# Altium schematic sheet DriverSignals.SchDoc: Driver Signals
size A4; CompanyName: TM; DrawnBy: Juan Tinazzo; SheetNumber: 6; SheetTotal: 7; Number: CB_DRV
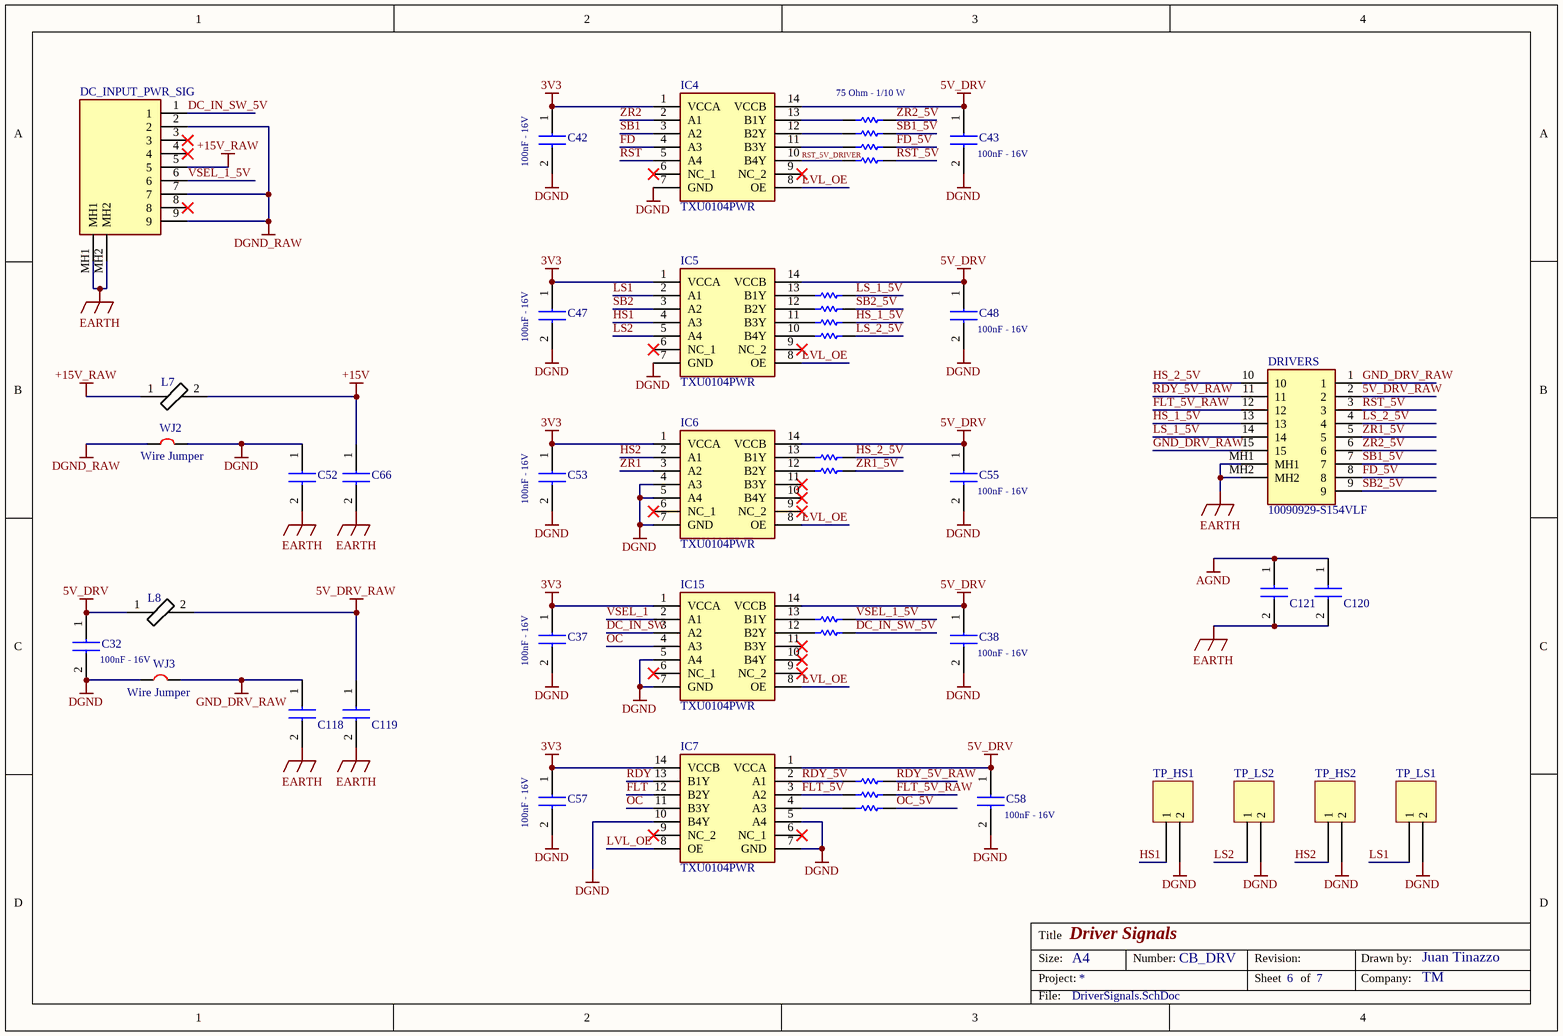
[diagram p0: DriverSignals.SchDoc]

## Parts
C32  value 100nF - 16V  [CAPC1608X95N]  (hidden comment: 100n 16V 0603)
C37  value 100nF - 16V  [CAPC1608X95N]  (hidden comment: 100n 16V 0603)
C38  value 100nF - 16V  [CAPC1608X95N]  (hidden comment: 100n 16V 0603)
C42  value 100nF - 16V  [CAPC1608X95N]  (hidden comment: 100n 16V 0603)
C43  value 100nF - 16V  [CAPC1608X95N]  (hidden comment: 100n 16V 0603)
C47  value 100nF - 16V  [CAPC1608X95N]  (hidden comment: 100n 16V 0603)
C48  value 100nF - 16V  [CAPC1608X95N]  (hidden comment: 100n 16V 0603)
C52  LDEQD1100KA5N00  [C_2220_1206]  (value not drawn)
C53  value 100nF - 16V  [CAPC1608X95N]  (hidden comment: 100n 16V 0603)
C55  value 100nF - 16V  [CAPC1608X95N]  (hidden comment: 100n 16V 0603)
C57  value 100nF - 16V  [CAPC1608X95N]  (hidden comment: 100n 16V 0603)
C58  value 100nF - 16V  [CAPC1608X95N]  (hidden comment: 100n 16V 0603)
C66  LDEQD1100KA5N00  [C_2220_1206]  (value not drawn)
C118  C1206C102KGRACAUTO  [C1206]  (value not drawn)
C119  C1206C102KGRACAUTO  [C1206]  (value not drawn)
C120  C1206C102KGRACAUTO  [C1206]  (value not drawn)
C121  C1206C102KGRACAUTO  [C1206]  (value not drawn)
DC_INPUT_PWR_SIG  L77TSEH09SOL2RM8  [L77TSEH09SOL2RM8]  (value not drawn)
DRIVERS  10090929-S154VLF  [10090929S154VLF]
IC4  TXU0104PWR  [SOP65P640X120-14N]
IC5  TXU0104PWR  [SOP65P640X120-14N]
IC6  TXU0104PWR  [SOP65P640X120-14N]
IC7  TXU0104PWR  [SOP65P640X120-14N]
IC15  TXU0104PWR  [SOP65P640X120-14N]
L7  78279220601  [BEADC2012X110N]  (value not drawn)
L8  78279220601  [BEADC2012X110N]  (value not drawn)
R43  value 75 Ohm - 1/10 W  [RESC1608X55N]  (hidden comment: CRCW060375R0FKEAC)
R44  CRCW060375R0FKEAC  [RESC1608X55N]  (value not drawn)
R45  CRCW060375R0FKEAC  [RESC1608X55N]  (value not drawn)
R46  CRCW060375R0FKEAC  [RESC1608X55N]  (value not drawn)
R47  CRCW060375R0FKEAC  [RESC1608X55N]  (value not drawn)
R49  CRCW060375R0FKEAC  [RESC1608X55N]  (value not drawn)
R50  CRCW060375R0FKEAC  [RESC1608X55N]  (value not drawn)
R51  CRCW060375R0FKEAC  [RESC1608X55N]  (value not drawn)
R56  CRCW060375R0FKEAC  [RESC1608X55N]  (value not drawn)
R57  CRCW060375R0FKEAC  [RESC1608X55N]  (value not drawn)
R58  CRCW060375R0FKEAC  [RESC1608X55N]  (value not drawn)
R59  CRCW060375R0FKEAC  [RESC1608X55N]  (value not drawn)
R102  CRCW060375R0FKEAC  [RESC1608X55N]  (value not drawn)
R103  CRCW060375R0FKEAC  [RESC1608X55N]  (value not drawn)
R104  CRCW060375R0FKEAC  [RESC1608X55N]  (value not drawn)
TP_HS1  Test_Point  [Test Point]  (value not drawn)
TP_HS2  Test_Point  [Test Point]  (value not drawn)
TP_LS1  Test_Point  [Test Point]  (value not drawn)
TP_LS2  Test_Point  [Test Point]  (value not drawn)
WJ2  Wire Jumper  (net tie, no BOM)
WJ3  Wire Jumper  (net tie, no BOM)

## Nets
3V3: C37.1 C42.1 C47.1 C53.1 C57.1 IC4.1(VCCA) IC5.1(VCCA) IC6.1(VCCA) IC7.14(VCCB) IC15.1(VCCA)
5V_DRV: C32.1 C38.1 C43.1 C48.1 C55.1 C58.1 IC4.14(VCCB) IC5.14(VCCB) IC6.14(VCCB) IC7.1(VCCA) IC15.14(VCCB) L8.1
5V_DRV_RAW: C119.1 DRIVERS.2 L8.2
+15V: C66.1 L7.2
+15V_RAW: DC_INPUT_PWR_SIG.5 L7.1
AGND: C120.1 C121.1
DGND: C32.2 C37.2 C38.2 C42.2 C43.2 C47.2 C48.2 C52.1 C53.2 C55.2 C57.2 C58.2 IC4.7(GND) IC5.7(GND) IC6.4(A3) IC6.5(A4) IC6.7(GND) IC7.5(A4) IC7.7(GND) IC7.10(B4Y) IC15.5(A4) IC15.7(GND) TP_HS1.2 TP_HS2.2 TP_LS1.2 TP_LS2.2 WJ2.1 WJ3.0
DGND_RAW: DC_INPUT_PWR_SIG.2 DC_INPUT_PWR_SIG.7 DC_INPUT_PWR_SIG.9 WJ2.0
EARTH: C52.2 C66.2 C118.2 C119.2 C120.2 C121.2 DC_INPUT_PWR_SIG.MH1 DC_INPUT_PWR_SIG.MH2 DRIVERS.MH1 DRIVERS.MH2
GND_DRV_RAW: C118.1 DRIVERS.1 DRIVERS.15 WJ3.1
DC_IN_SW: IC15.3(A2)
DC_IN_SW_5V: DC_INPUT_PWR_SIG.1 R103.2
FD: IC4.4(A3)
FD_5V: DRIVERS.8 R45.2
FLT: IC7.12(B2Y)
FLT_5V: IC7.3(A2) R59.1
FLT_5V_RAW: DRIVERS.12 R59.2
HS1: IC5.4(A3) TP_HS1.1
HS2: IC6.2(A1) TP_HS2.1
HS_1_5V: DRIVERS.13 R50.2
HS_2_5V: DRIVERS.10 R56.2
LS1: IC5.2(A1) TP_LS1.1
LS2: IC5.5(A4) TP_LS2.1
LS_1_5V: DRIVERS.14 R47.2
LS_2_5V: DRIVERS.4 R51.2
LVL_OE: IC4.8(OE) IC5.8(OE) IC6.8(OE) IC7.8(OE) IC15.8(OE)
OC: IC7.11(B3Y) IC15.4(A3)
OC_5V: R104.2
RDY: IC7.13(B1Y)
RDY_5V: IC7.2(A1) R58.1
RDY_5V_RAW: DRIVERS.11 R58.2
RST: IC4.5(A4)
RST_5V: DRIVERS.3 R46.2
RST_5V_DRIVER: IC4.10(B4Y) R46.1
SB1: IC4.3(A2)
SB1_5V: DRIVERS.7 R44.2
SB2: IC5.3(A2)
SB2_5V: DRIVERS.9 R49.2
VSEL_1: IC15.2(A1)
VSEL_1_5V: DC_INPUT_PWR_SIG.6 R102.2
ZR1: IC6.3(A2)
ZR1_5V: DRIVERS.5 R57.2
ZR2: IC4.2(A1)
ZR2_5V: DRIVERS.6 R43.2
NetIC4_11: IC4.11(B3Y) R45.1
NetIC4_12: IC4.12(B2Y) R44.1
NetIC4_13: IC4.13(B1Y) R43.1
NetIC5_10: IC5.10(B4Y) R51.1
NetIC5_11: IC5.11(B3Y) R50.1
NetIC5_12: IC5.12(B2Y) R49.1
NetIC5_13: IC5.13(B1Y) R47.1
NetIC6_12: IC6.12(B2Y) R57.1
NetIC6_13: IC6.13(B1Y) R56.1
NetIC7_4: IC7.4(A3) R104.1
NetIC15_12: IC15.12(B2Y) R103.1
NetIC15_13: IC15.13(B1Y) R102.1

Not connected (* = marked no-connect by the designer): DC_INPUT_PWR_SIG 3* 4* 8*; IC4 6(NC_1)* 9(NC_2)*; IC5 6(NC_1)* 9(NC_2)*; IC6 6(NC_1)* 9(NC_2)* 10(B4Y)* 11(B3Y)*; IC7 6(NC_1)* 9(NC_2)*; IC15 6(NC_1)* 9(NC_2)* 10(B4Y)* 11(B3Y)*

## Notes on the sheet
- OC en PIN 4 quedó por un arreglo
- Title
- Size:
- Project:
- A4
- Number:
- Revision:
- Sheet
- of
- Drawn by:
- Company:
- File:

## Library data of the parts
C32 C37 C38 C42 C43 C47 C48 C53 C55 C57 C58 = EMK107B7104KA-T: Capacitor; Manufacturer_Name: TAIYO YUDEN; Datasheet Link: http://www.farnell.com/datasheets/746258.pdf; Height: 0.95mm; Manufacturer_Part_Number: EMK107B7104KA-T; Mouser Part Number: 963-EMK107B7104KA-T; Mouser Price/Stock: https://www.mouser.co.uk/ProductDetail/Taiyo-Yuden/EMK107B7104KA-T?qs=I6KAKw0tg2ybqzX8hKPgfw%3D%3D; Arrow Part Number: EMK107B7104KA-T; Arrow Price/Stock: https://www.arrow.com/en/products/emk107b7104ka-t/taiyo-yuden
C52 C66 = LDEQD1100KA5N00: Capacitor; Manufacturer_Name: KEMET; Value: 1nF - 1000V; Datasheet Link: https://content.kemet.com/datasheets/KEM_F3078_LDE.pdf; Height: 1.9mm; Manufacturer_Part_Number: LDEQD1100KA5N00; Mouser Part Number: 80-LDEQD1100KA5N00; Mouser Price/Stock: https://www.mouser.co.uk/ProductDetail/KEMET/LDEQD1100KA5N00?qs=MdJgNetHbfkxq2yA6XdGCw%3D%3D
C118-C121 = C1206C102KGRACAUTO: Capacitor; Manufacturer_Name: KEMET; Value: 1nF - 2000V; Datasheet Link: https://content.kemet.com/datasheets/KEM_C1076_X7R_HV_AUTO_SMD.pdf; Manufacturer_Part_Number: C1206C102KGRACAUTO; Mouser Part Number: 80-C1206C102KGRAUTO; Mouser Price/Stock: https://www.mouser.co.uk/ProductDetail/KEMET/C1206C102KGRACAUTO?qs=02kMkzikyGKenJNcwYLRQw%3D%3D; Arrow Part Number: C1206C102KGRACAUTO; Arrow Price/Stock: https://www.arrow.com/en/products/c1206c102kgracauto/kemet-corporation?region=nac
DC_INPUT_PWR_SIG = L77TSEH09SOL2RM8: Connector; Manufacturer_Name: Amphenol Communications Solutions; Value: Conectores estándar subminiatura D D-SUB; Datasheet Link: https://cdn.amphenol-cs.com/media/wysiwyg/files/drawing/l77tsxhxxsol2rm8.pdf; Height: 12.3mm; Manufacturer_Part_Number: L77TSEH09SOL2RM8; Mouser Part Number: 523-L77TSEH09SOL2RM8; Mouser Price/Stock: https://www.mouser.co.uk/ProductDetail/Amphenol-Commercial-Products/L77TSEH09SOL2RM8?qs=mq7kV%2Fq8lk5RvjourI%2Fduw%3D%3D; Arrow Part Number: L77TSEH09SOL2RM8; Arrow Price/Stock: https://www.arrow.com/en/products/l77tseh09sol2rm8/amphenol-fci?region=nac; System: Connector
DRIVERS = 10090929-S154VLF: Connector; Manufacturer_Name: Amphenol Communications Solutions; Value: Conectores de alta densidad subminiatura D 15P; Datasheet Link: https://cdn.amphenol-cs.com/media/wysiwyg/files/drawing/10090929.pdf; Height: 12.4mm; Manufacturer_Part_Number: 10090929-S154VLF; Mouser Part Number: 649-10090929-S154VLF; System: Connector
IC4-IC7 IC15 = TXU0104PWR: Integrated Circuit; Manufacturer_Name: Texas Instruments; Value: Four channel unidirectional level shifter; Datasheet Link: https://www.ti.com/lit/ds/symlink/txu0104.pdf?ts=1625451640473&ref_url=https%253A%252F%252Fwww.ti.com%252Fsitesearch%252Fdocs%252Funiversalsearch.tsp%253FlangPref%253Den-US%2526searchTerm%253DTXU0104PWR%2526nr%253D4; Height: 1.2mm; Manufacturer_Part_Number: TXU0104PWR; Mouser Part Number: 595-TXU0104PWR; Mouser Price/Stock: https://www.mouser.co.uk/ProductDetail/Texas-Instruments/TXU0104PWR?qs=QNEnbhJQKvYcSGbLlthvAQ%3D%3D; Arrow Part Number: TXU0104PWR; Arrow Price/Stock: https://www.arrow.com/en/products/txu0104pwr/texas-instruments?region=nac
L7 L8 = 78279220601: Ferrite Bead; Manufacturer_Name: Wurth Elektronik; Value: Núcleos de ferrita WE-MPSA EMI 600Ohms 2.1A 80mOhms; Datasheet Link: https://www.mouser.de/datasheet/2/445/78279220601-2298574.pdf; Height: 1.1mm; Manufacturer_Part_Number: 78279220601; Mouser Part Number: 710-78279220601; Mouser Price/Stock: https://www.mouser.co.uk/ProductDetail/Wurth-Elektronik/78279220601?qs=iLbezkQI%252BsjgiK1FovJqGg%3D%3D
R43 = CRCW060375R0FKEAC: Resistor; Manufacturer_Name: Vishay; Datasheet Link: https://www.arrow.com/en/products/crcw060375r0fkeac/vishay; Height: 0.55mm; Manufacturer_Part_Number: CRCW060375R0FKEAC; Mouser Part Number: 71-CRCW060375R0FKEAC; Mouser Price/Stock: https://www.mouser.co.uk/ProductDetail/Vishay-Dale/CRCW060375R0FKEAC?qs=E3Y5ESvWgWPOxF9wqCfv4A%3D%3D; Arrow Part Number: CRCW060375R0FKEAC; Arrow Price/Stock: https://www.arrow.com/en/products/crcw060375r0fkeac/vishay?region=nac
R44-R47 R49-R51 R56-R59 R102-R104 = CRCW060375R0FKEAC: Resistor; Manufacturer_Name: Vishay; Value: 75 Ohm - 1/10 W; Datasheet Link: https://www.arrow.com/en/products/crcw060375r0fkeac/vishay; Height: 0.55mm; Manufacturer_Part_Number: CRCW060375R0FKEAC; Mouser Part Number: 71-CRCW060375R0FKEAC; Mouser Price/Stock: https://www.mouser.co.uk/ProductDetail/Vishay-Dale/CRCW060375R0FKEAC?qs=E3Y5ESvWgWPOxF9wqCfv4A%3D%3D; Arrow Part Number: CRCW060375R0FKEAC; Arrow Price/Stock: https://www.arrow.com/en/products/crcw060375r0fkeac/vishay?region=nac
TP_HS1 TP_HS2 TP_LS1 TP_LS2 = Test_Point: Punta Prueba Osciloscopio; Manufacturer_Part_Number: PCB; Value: TP
WJ2 WJ3 = Wire Jumper: Manufacturer_Part_Number: Wire